# EAGLE design STM32L052_Breadboard (EAGLE 7.7.0)
CNAME: CC Attribution-ShareAlike 3.0; CREVISION: 1.0; DESIGNER: Oliv4945
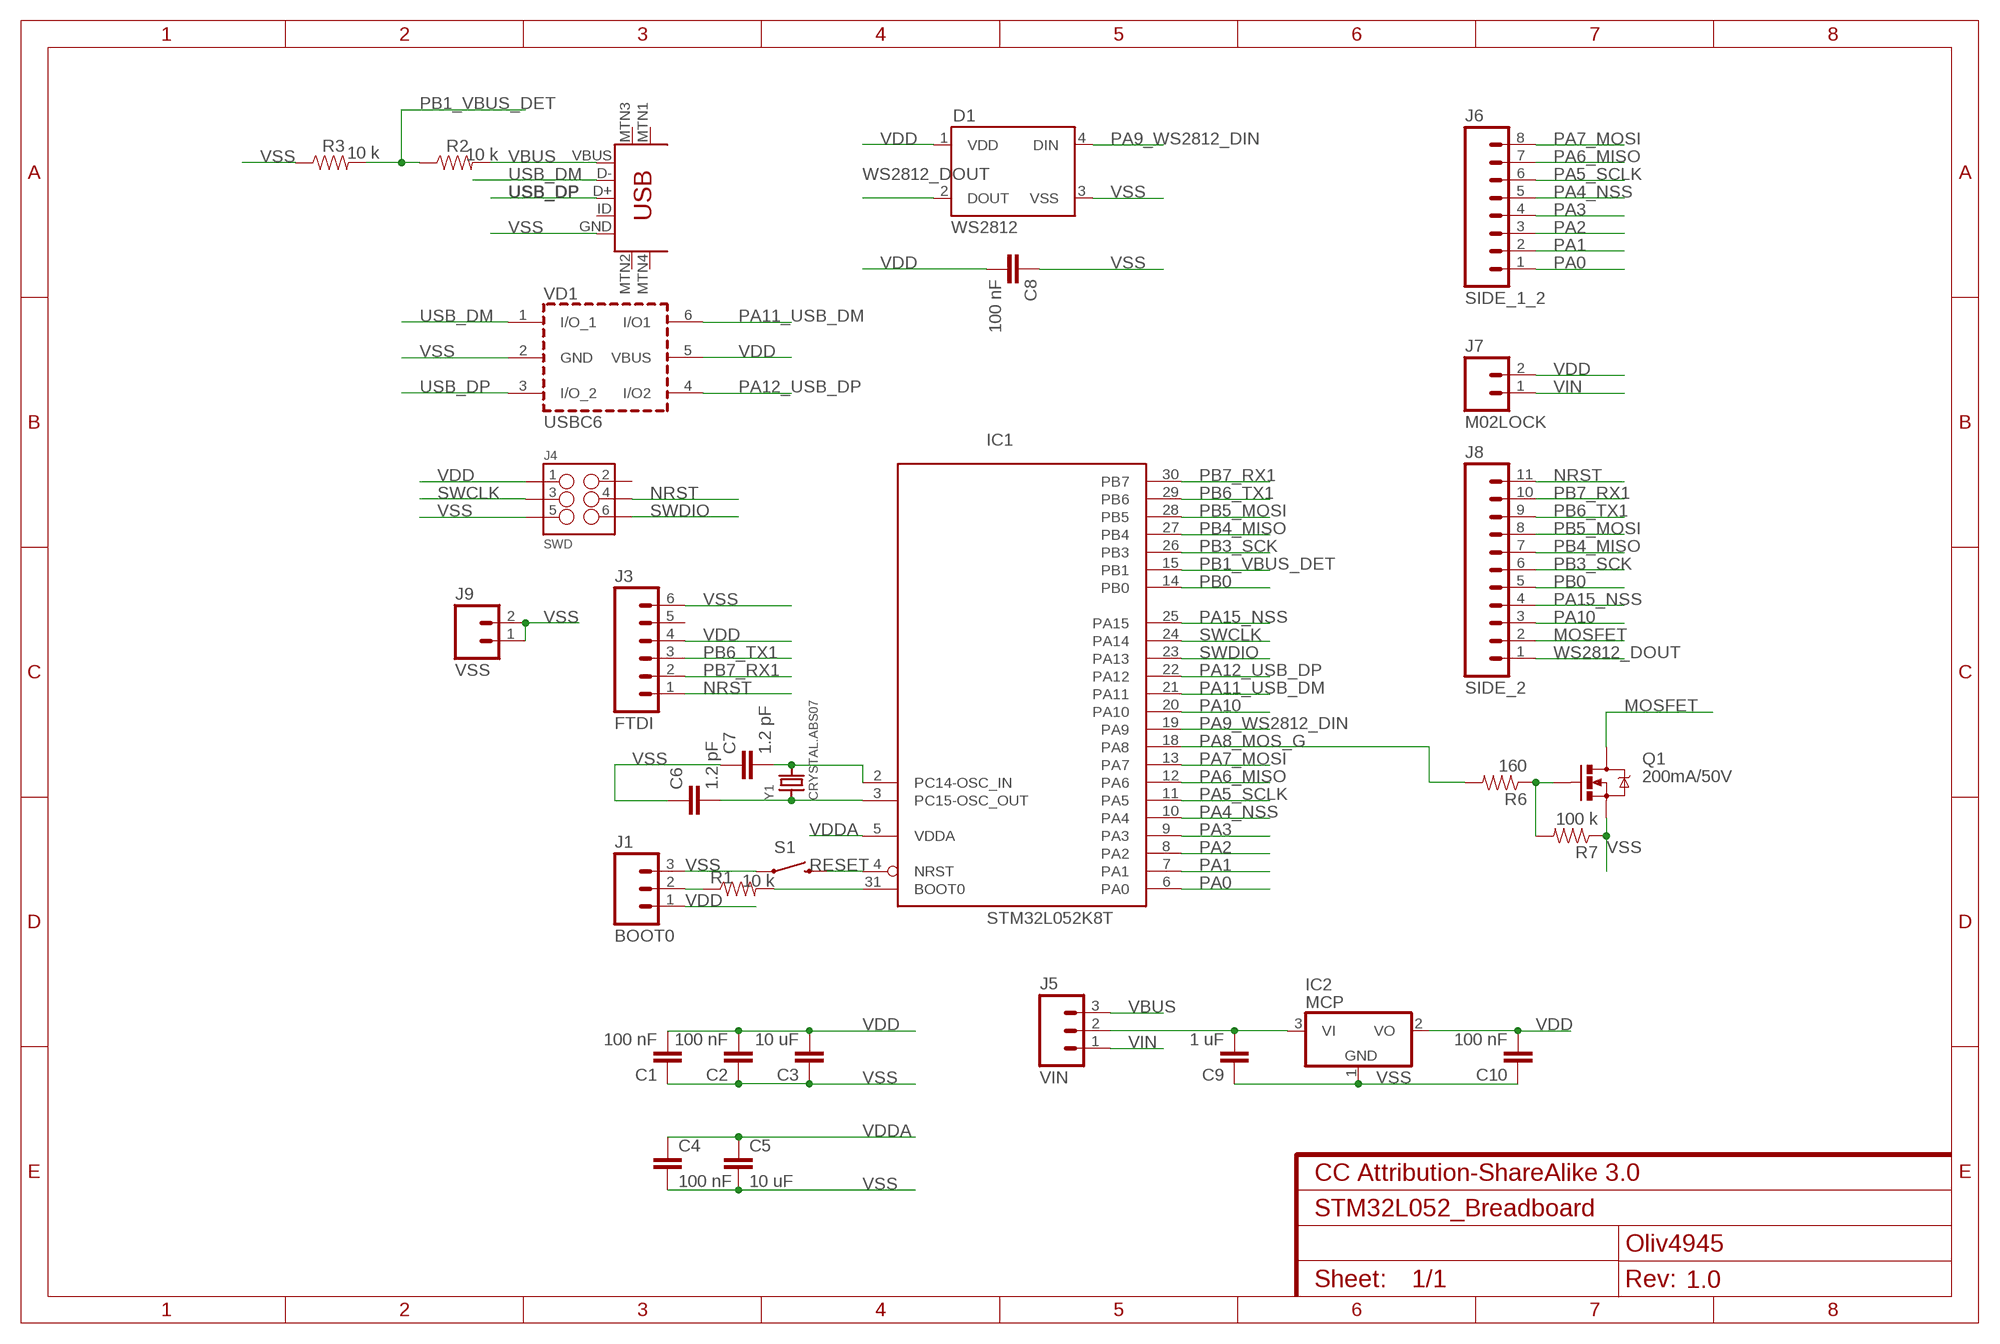
[diagram p0: schematic, sheet 1]

## Parts
C1  100 nF  CAP0603-CAP  [0603-CAP]
C2  100 nF  CAP0603-CAP  [0603-CAP]
C3  10 uF  CAP0603-CAP  [0603-CAP]
C4  100 nF  CAP0603-CAP  [0603-CAP]
C5  10 uF  CAP0603-CAP  [0603-CAP]
C6  1.2 pF  CAP0603-CAP  [0603-CAP]
C7  1.2 pF  CAP0603-CAP  [0603-CAP]
C8  100 nF  CAP0603-CAP  [0603-CAP]
C9  1 uF  CAP0603-CAP  [0603-CAP]
C10  100 nF  CAP0603-CAP  [0603-CAP]
D1  WS2812  WS2812B  [WS2812B]
IC1  STM32L052K8T  [LQFP32]
IC2  MCP  MCP1703CB  [SOT23]
J1  BOOT0  M03LOCK  [1X03_LOCK]
J3  FTDI  M06LOCK  [1X06_LOCK]
J4  SWD  M03X2FEMALE  [2X3]
J5  VIN  M03LOCK  [1X03_LOCK]
J6  SIDE_1_2  M08LOCK  [1X08_LOCK]
J7  M02LOCK  [1X02_LOCK]
J8  SIDE_2  M11LOCK  [1X11_LOCK]
J9  VSS  M02LOCK  [1X02_LOCK]
Q1  200mA/50V  MOSFET-NCHANNELBSS138  [SOT23-3]
R1  10 k  RESISTOR0603  [0603-RES]
R2  10 k  RESISTOR0603  [0603-RES]
R3  10 k  RESISTOR0603  [0603-RES]
R6  160  RESISTOR0805-RES  [0805]
R7  100 k  RESISTOR0805-RES  [0805]
S1  RESET  SWITCH-MOMENTARY-2SMD  [TACTILE-SWITCH-SMD]
U$1  USB-MINIB-5PIN  [USB-MINIB]
VD1  USBC6  USBLC6-2SC6  [SOT-23-6L]
Y1  CRYSTAL.ABS07  [ABS07]

## Nets
BOOT0: IC1.31(BOOT0) R1.2
BOOT0_SEL: J1.2 R1.1
MOSFET: J8.2 Q1.3(D)
N$11: Q1.1(G) R6.1 R7.2
NRST: IC1.4(NRST) J3.1 J4.4 J8.11 S1.3
OSC_IN: C7.2 IC1.2(PC14-OSC_IN) Y1.2
OSC_OUT: C6.2 IC1.3(PC15-OSC_OUT) Y1.1
PA0: IC1.6(PA0) J6.1
PA1: IC1.7(PA1) J6.2
PA2: IC1.8(PA2) J6.3
PA3: IC1.9(PA3) J6.4
PA4_NSS: IC1.10(PA4) J6.5
PA5_SCLK: IC1.11(PA5) J6.6
PA6_MISO: IC1.12(PA6) J6.7
PA7_MOSI: IC1.13(PA7) J6.8
PA8_MOS_G: IC1.18(PA8) R6.2
PA9_WS2812_DIN: D1.4(DIN) IC1.19(PA9)
PA10: IC1.20(PA10) J8.3
PA11_USB_DM: IC1.21(PA11) VD1.6(I/O1)
PA12_USB_DP: IC1.22(PA12) VD1.4(I/O2)
PA15_NSS: IC1.25(PA15) J8.4
PB0: IC1.14(PB0) J8.5
PB1_VBUS_DET: IC1.15(PB1) R2.1 R3.2
PB3_SCK: IC1.26(PB3) J8.6
PB4_MISO: IC1.27(PB4) J8.7
PB5_MOSI: IC1.28(PB5) J8.8
PB6_TX1: IC1.29(PB6) J3.3 J8.9
PB7_RX1: IC1.30(PB7) J3.2 J8.10
SWCLK: IC1.24(PA14) J4.3
SWDIO: IC1.23(PA13) J4.6
USB_DM: U$1.D- VD1.1(I/O_1)
USB_DP: U$1.D+ VD1.3(I/O_2)
VBUS: J5.3 R2.2 U$1.VBUS
VDD: C1.2 C2.2 C3.2 C8.2 C10.2 D1.1(VDD) IC2.2(VO) J1.1 J3.4 J4.1 J7.2 VD1.5(VBUS)
VDDA: C4.1 C5.1 IC1.5(VDDA)
VIN: J5.1 J7.1
VIN_ALL: C9.2 IC2.3(VI) J5.2
VSS: C1.1 C2.1 C3.1 C4.2 C5.2 C6.1 C7.1 C8.1 C9.1 C10.1 D1.3(VSS) IC2.1(GND) J1.3 J3.6 J4.5 J9.1 J9.2 Q1.2(S) R3.1 R7.1 S1.1 U$1.GND VD1.2(GND)
WS2812_DOUT: D1.2(DOUT) J8.1
Unconnected: J3.5 J4.2 U$1.ID U$1.MTN1(MTN2) U$1.MTN2(MTN3) U$1.MTN3(MTN1) U$1.MTN4

## Power pins joined to a net without a drawn wire
VDD: IC1.1(VDD) IC1.17(VDD)
VSS: IC1.16(VSS) IC1.32(VSS)

## Library data of the parts
C1-C10 = SparkFun-Capacitors:CAP: Capacitor Standard 0603 ceramic capacitor, and 0.1" leaded capacitor.
D1 = SparkFun-LED:WS2812B: WS2812B - Intelligent control LED integrated light source Technical Specifications: Power Supply Voltage (VDD): 3.5 to 5.3 V Input Voltage (VI): -0.5 to VDD+0.5 V Operating Junction Temperature (Topt): -25°C to +80°C Storage Temperature Range (Tstg): -55°C to +150°C; PROD_ID: DIO-12503
IC1 = micro-stm_v3:STM32L052K*T: ARM 32-bit Cortex™-M0+ CPU 32 MHz maximum frequency 32 to 64 Kbytes of Flash memory 2 kbyte of Data EEPROM 8 kbytes of SRAM 27 GPIOs 1.8 to 3.6 V application supply
IC2 = linear:MCP1703: 250 mA, 16V, Low Quiescent Current LDO Regulator Source: http://ww1.microchip.com/downloads/en/DeviceDoc/22049b.pdf
J1 J5 = SparkFun-Connectors:M03: Header 3 Standard 3-pin 0.1" header. Use with straight break away headers (SKU : PRT-00116), right angle break away headers (PRT-00553), swiss pins (PRT-00743), machine pins (PRT-00117), and female headers (PRT-00115). Molex polarized connector foot print use with SKU : PRT-08232 with associated crimp pins and housings.
J3 = SparkFun-Connectors:M06: Header 6 Standard 6-pin 0.1" header. Use with straight break away headers (SKU : PRT-00116), right angle break away headers (PRT-00553), swiss pins (PRT-00743), machine pins (PRT-00117), and female headers (PRT-00115). Molex polarized connector foot print use with SKU : PRT-08094 with associated crimp pins and housings. NOTES ON THE VARIANTS LOCK and LOCK_LONGPADS... This footprint was designed to help hold the alignment of a through-hole component (i.e. 6-pin header) while soldering it into place. You may notice that each hole has been shifted either up or down by 0.005 of an inch from it's more standard position (which is a perfectly straight line). This slight alteration caused the pins (the squares in the middle) to touch the edges of the holes. Because they are alternating, it causes a "brace" to hold the component in place. 0.005 has proven to be the perfect amount of "off-center" position when using our standard breakaway headers. Although looks a little odd when you look at the bare footprint, once you have a header in there, the alteration is very hard to notice. Also,if you push a header all the way into place, it is covered up entirely on the bottom side. This idea of altering the position of holes to aid alignment will be further integrated into the Sparkfun Library for other footprints. It can help hold any component with 3 or more connection pins.
J4 = SparkFun-Connectors:M03X2: 2x3 .1" header. Shrouded, with keying- CONN-10681 SMT- CONN-11415 Pogo pins- HW-11044; PROD_ID: CONN-11566; VALUE: FEMALE 2x3
J6 = SparkFun-Connectors:M08: Header 8 Standard 8-pin 0.1" header. Use with straight break away headers (SKU : PRT-00116), right angle break away headers (PRT-00553), swiss pins (PRT-00743), machine pins (PRT-00117), and female headers (PRT-00115).
J7 J9 = SparkFun-Connectors:M02: Standard 2-pin 0.1" header. Use with - straight break away headers ( PRT-00116) - right angle break away headers (PRT-00553) - swiss pins (PRT-00743) - machine pins (PRT-00117) - female headers (PRT-00115) Molex polarized connector foot print use with: PRT-08233 with associated crimp pins and housings. 2.54_SCREWTERM for use with PRT-10571. 3.5mm Screw Terminal footprints for PRT-08084 5mm Screw Terminal footprints for use with PRT-08432
J8 = SparkFun-Connectors:M11: Header 11 Standard 11-pin 0.1" header. Use with straight break away headers (SKU : PRT-00116), right angle break away headers (PRT-00553), swiss pins (PRT-00743), machine pins (PRT-00117), and female headers (PRT-00115).
Q1 = SparkFun-DiscreteSemi:MOSFET-NCHANNEL: Common NMOSFET Parts MFG P/N Store ID Prod ID FDD8780 TRANS-09984 SI7820DN TRANS-11055 FDS6630A IC-08089 2N7002PW TRANS-11151 FQP30N06L COM-10213 TRANS-10060 BSS123LT1G TRANS-08345 BSS138 TRANS-00830 BS170 2N7000; PROD_ID: TRANS-00830
R1-R3 = SparkFun-Resistors:RESISTOR: Resistor Basic schematic elements and footprints for 0603, 1206, and PTH resistors.
R6 R7 = SparkFun-Passives:RESISTOR: Resistor Basic schematic elements and footprints for 0603, 1206, and PTH resistors.
S1 = SparkFun-Electromechanical:SWITCH-MOMENTARY-2: Various NO switches- pushbuttons, reed, etc; PROD_ID: SWCH-08247
U$1 = SparkFun-Connectors:USB-MINIB: Mini-USB "B" connector with 5th pin broken out. Created new symbol breaking out 5th "ID" pin in mini/micro USB connector spec. See: http://en.wikipedia.org/wiki/Mini_usb#Cables. Uses same footprint as 4-pin symbol. Also added pins to connect to mounting / shield pads if required (probably not generally needed as signals aren't shielded once they leave the connector).
VD1 = usblc6:USBLC6-2: VERY LOW CAPACITANCE ESD PROTECTION 2 line Datasheet link <http://www.st.com/web/catalog/sense_power/FM114/CL1137/SC1489/PF93353>
Y1 = Abracorn:CRYSTAL

## Board
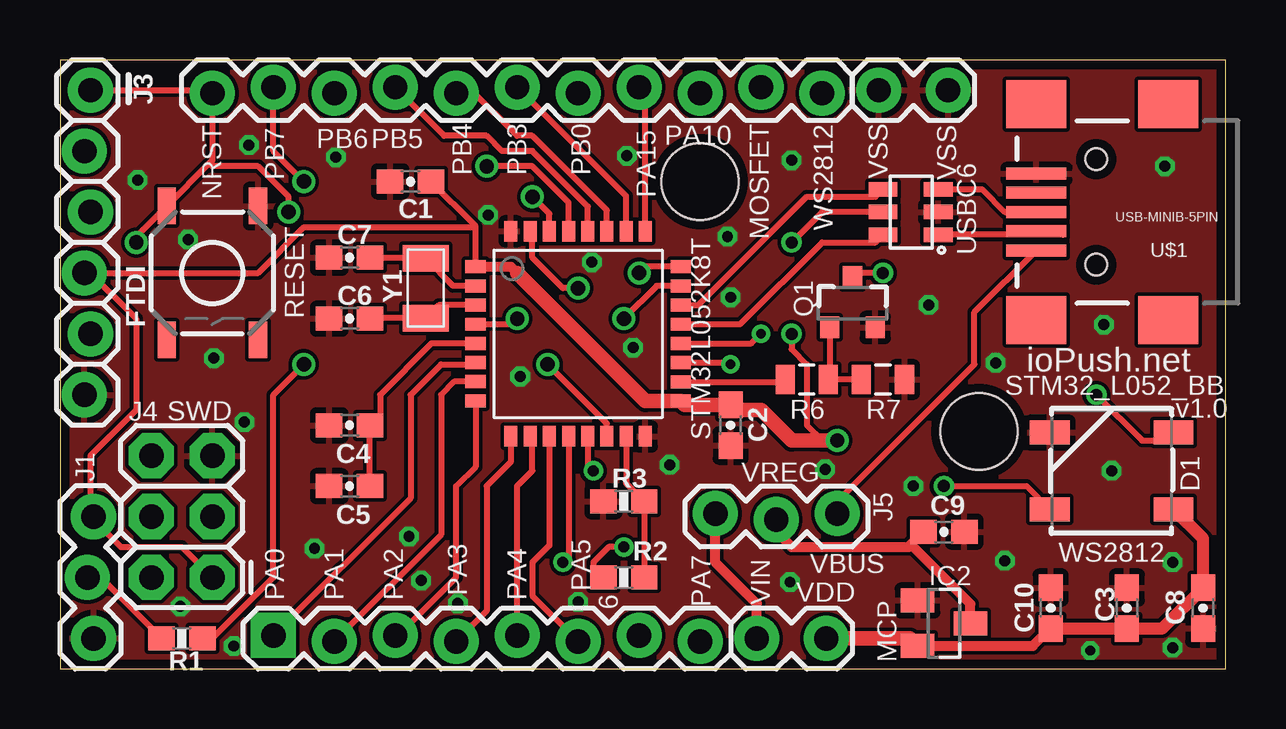
[diagram p1: board, top side]
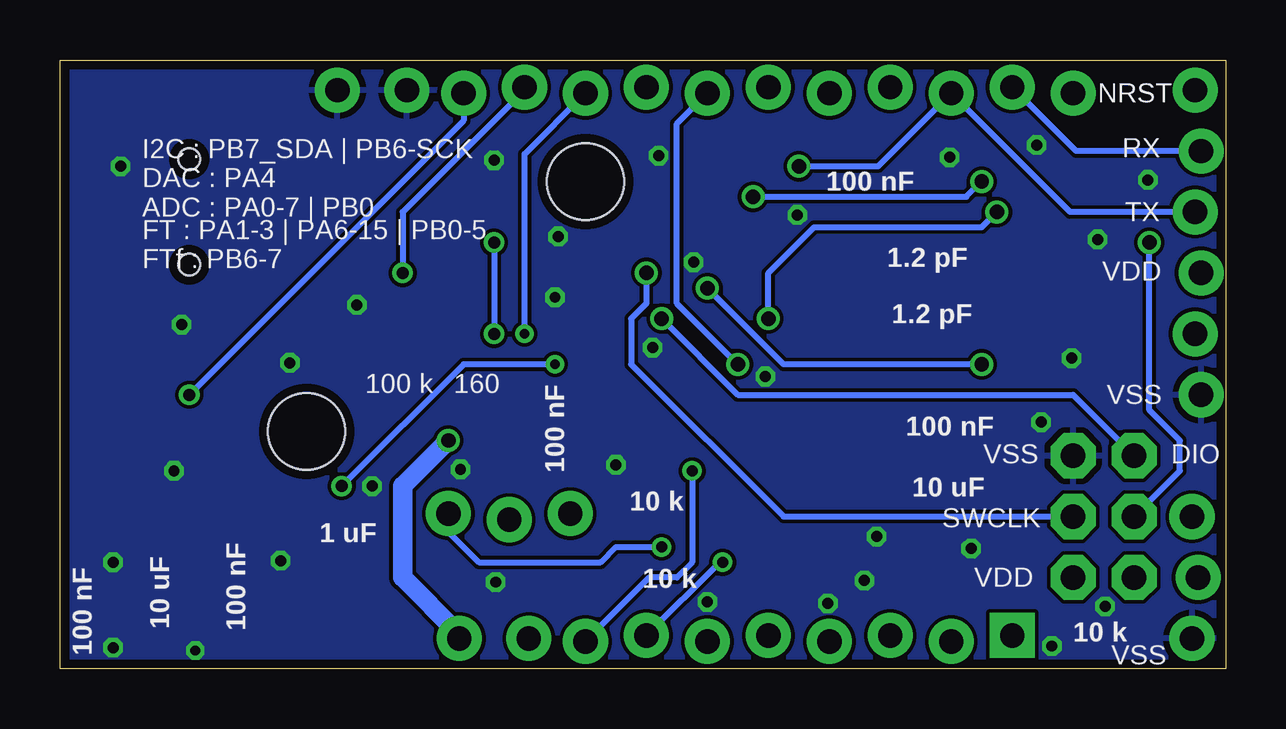
[diagram p2: board, bottom side, seen from below]

Size 48.56 x 25.39 mm. Coordinates in mm from the lower left corner, seen from the top.
Outline: 0,0 48.56,0 48.56,25.39 0,25.39 0,0
Copper layers (1*16): Top 0.0356mm / dielectric 1.5011mm / Bottom 0.0356mm
Design rules "oshpark-2layer": minimum track width 6mil, minimum drill 13mil, track to track 6mil, track to pad 6mil, pad to pad 6mil, via to via 6mil, smd to smd 6mil, copper to edge 15mil, drill to drill 6mil, minimum pad ring 7mil, minimum via ring 7mil, stop-mask expansion 2.5mil, vias tented up to drill 0mil, thermal gap 10mil
Holes 3.2 mm at 38.29,9.91 26.67,20.32

### Footprints (pad centres in the part's own frame; a part is rotated, then mirrored left to right if it is on the bottom)
0603-CAP = smd 1.1 x 1: 1 -0.85,0; 2 0.85,0
WS2812B = smd 1.651 x 1: 1 -2.577,1.6; 2 -2.577,-1.6; 3 2.577,-1.6; 4 2.577,1.6
LQFP32 = smd 0.54 x 0.85: 1 -2.8,-4.275; 2 -2,-4.275; 3 -1.2,-4.275; 4 -0.4,-4.275; 5 0.4,-4.275; 6 1.19,-4.275; 7 1.99,-4.275; 8 2.79,-4.275; 17 2.8,4.275; 18 2,4.275; 19 1.2,4.275; 20 0.4,4.275; 21 -0.4,4.275; 22 -1.2,4.275; 23 -2,4.275; 24 -2.8,4.275 | smd 0.85 x 0.54: 9 4.275,-2.8; 10 4.275,-2; 11 4.275,-1.2; 12 4.275,-0.4; 13 4.275,0.4; 14 4.275,1.2; 15 4.275,2; 16 4.275,2.8; 25 -4.275,2.8; 26 -4.275,2; 27 -4.275,1.2; 28 -4.275,0.4; 29 -4.275,-0.4; 30 -4.275,-1.2; 31 -4.275,-2; 32 -4.275,-2.8
SOT23 = smd 1 x 1.4: 1 -0.95,-1.1; 2 0.95,-1.1; 3 0,1.1
1X03_LOCK = drill 1.016 pad 1.88: 1 0,0.127; 2 2.54,-0.127; 3 5.08,0.127
1X06_LOCK = drill 1.016 pad 1.88: 1 0,0; 2 2.54,-0.254; 3 5.08,0; 4 7.62,-0.254; 5 10.16,0; 6 12.7,-0.254
2X3 = drill 1.016 pad 1.88 octagon: 1 0,0; 2 0,2.54; 3 2.54,0; 4 2.54,2.54; 5 5.08,0; 6 5.08,2.54
1X08_LOCK = drill 1.016 pad 1.88 square: 1 0,0.127 | drill 1.016 pad 1.88: 2 2.54,-0.127; 3 5.08,0.127; 4 7.62,-0.127; 5 10.16,0.127; 6 12.7,-0.127; 7 15.24,0.127; 8 17.78,-0.127
1X02_LOCK = drill 1.016 pad 1.88: 1 -0.178,0; 2 2.718,0
1X11_LOCK = drill 1.016 pad 1.88: 1 0,0.127; 2 2.54,-0.127; 3 5.08,0.127; 4 7.62,-0.127; 5 10.16,0.127; 6 12.7,-0.127; 7 15.24,0.127; 8 17.78,-0.127; 9 20.32,0.127; 10 22.86,-0.127; 11 25.4,0.127
SOT23-3 = smd 0.8 x 0.9: 1 -0.95,-1; 2 0.95,-1; 3 0,1.1
0603-RES = smd 1.1 x 1: 1 -0.85,0; 2 0.85,0
0805 = smd 0.8 x 1.2: 1 -0.9,0; 2 0.9,0
TACTILE-SWITCH-SMD = smd 1.524 x 0.762: 1 -2.794,1.905; 2 2.794,1.905; 3 -2.794,-1.905; 4 2.794,-1.905
USB-MINIB = smd 2.5 x 0.5: D+ 2.5,0; D- 2.5,0.8; GND 2.5,-1.6; ID 2.5,-0.8; VBUS 2.5,1.6 | smd 2.5 x 2: MTN1 -3,4.5; MTN2 2.5,4.5; MTN3 -3,-4.5; MTN4 2.5,-4.5 | hole 0.9: 0,2.2; 0,-2.2
SOT-23-6L = smd 0.6 x 1.2: 1 -0.95,-2.3; 2 0,-2.3; 3 0.95,-2.3; 4 0.95,0; 5 0,0; 6 -0.95,0
ABS07 = smd 1.1 x 1.9: 1 -1.25,0; 2 1.25,0

### Placement (x,y rotation side)
C1  14.61,20.32 0 top
C2  27.94,10.16 90 top
C3  44.45,2.54 270 top
C4  12.06,10.16 180 top
C5  12.06,7.62 180 top
C6  12.06,14.61 0 top
C7  12.06,17.14 0 top
C8  47.62,2.54 90 top
C9  36.83,5.71 180 top
C10  41.27,2.54 270 top
D1  43.81,8.26 180 top
IC1  21.59,13.97 270 top
IC2  36.83,1.91 270 top
J1  1.27,6.35 270 top
J3  1.27,24.13 270 top
J4  6.35,3.81 90 top
J5  27.3,6.35 0 top
J6  8.89,1.27 0 top
J7  29.21,1.27 0 top
J8  31.75,24.13 180 top
J9  34.29,24.13 0 top
Q1  33.02,15.24 0 top
R1  5.08,1.27 0 top
R2  23.5,3.81 180 top
R3  23.5,6.99 0 top
R6  31.11,12.06 180 top
R7  34.29,12.06 180 top
S1  6.35,16.51 270 top
U$1  43.18,19.05 180 top
VD1  34.29,19.05 90 top
Y1  15.24,15.88 90 top

### Tracks (layer width: path | path; a pad name or v marks a point on that pad's centre or on a via)
BOOT0  (via drill 0.6 pad 0.41)
  Top 0.254: R1.2 6.35,1.27 8.89,3.81 8.89,11.43 v10.16,12.7 | v21.59,15.88 20.95,15.88 19.68,17.14 19.68,18.15 IC1.31
  Bottom 0.254: v10.16,12.7 18.41,12.7 v21.59,15.88
BOOT0_SEL
  Top 0.254: J1.2 1.69,3.81 R1.1
MOSFET  (via drill 0.5)
  Top 0.254: v34.29,16.51 33.19,16.51 Q1.3
  Bottom 0.254: J8.2 29.21,24.13 34.29,19.05 v34.29,16.51
N$11
  Top 0.254: R7.2 R6.1 32.07,12.12 Q1.1
NRST  (via drill 0.6 pad 0.41)
  Top 0.254: v3.17,17.78 3.17,18.03 S1.3 6.22,21.08 | J3.1 6.22,24.13 J8.11 6.35,21.21 6.22,21.08 | IC1.4 18.82,14.37 v19.05,14.61 | v9.53,19.05 9.53,19.68 8.26,20.95 6.35,20.95 6.22,21.08
  Bottom 0.254: J4.4 1.91,8.26 1.91,9.53 3.17,10.79 v3.17,17.78 | v19.05,14.61 19.05,16.51 17.14,18.41 10.16,18.41 v9.53,19.05
OSC_IN
  Top 0.254: IC1.2 16.39,15.97 Y1.2 15.22,17.14 C7.2
OSC_OUT
  Top 0.254: IC1.3 15.79,15.17 Y1.1 12.94,14.62 C6.2
PA0
  Top 0.254: 17.23,12.78 IC1.6 17.23,12.7 15.88,12.7 14.61,11.43 14.61,7.11 J6.1
PA1
  Top 0.254: IC1.7 16.43,11.98 15.88,11.43 15.88,5.59 J6.2
PA2
  Top 0.254: IC1.8 17.32,8.43 16.51,7.62 16.51,3.81 14.1,1.4 J6.3
PA3
  Top 0.254: IC1.9 18.79,8.63 17.78,7.62 17.78,2.41 J6.4
PA4_NSS
  Top 0.254: J6.5 19.05,7.62 19.68,8.26 19.68,9.6 IC1.10
PA5_SCLK
  Top 0.254: IC1.11 20.39,5.15 19.68,4.45 19.68,3.05 J6.6
PA6_MISO  (via drill 0.46)
  Top 0.254: IC1.12 21.19,4.68 v20.95,4.45
  Bottom 0.254: v20.95,4.45 21.08,4.45 J6.7
PA7_MOSI  (via drill 0.46)
  Top 0.254: IC1.13 21.99,8.49 v22.23,8.26
  Bottom 0.254: v22.23,8.26 22.23,4.45 22.86,3.81 24,3.81 J6.8
PA8_MOS_G
  Top 0.254: IC1.18 30.12,11.97 R6.2
PA9_WS2812_DIN  (via drill 0.41 pad 0.41, 0.5)
  Top 0.254: IC1.19 27.87,12.77 v27.94,12.7 | v36.83,7.62 40.27,7.62 D1.4
  Bottom 0.254: v27.94,12.7 31.75,12.7 v36.83,7.62
PA10  (via drill 0.41)
  Top 0.254: IC1.20 28.81,13.57 v29.21,13.97
  Bottom 0.254: v29.21,13.97 29.21,21.46 J8.3
PA11_USB_DM
  Top 0.254: IC1.21 28.34,14.37 31.75,17.78 33.97,17.78 VD1.6
PA12_USB_DP
  Top 0.254: IC1.22 26.6,15.17 31.11,19.68 33.98,19.68 VD1.4
PA15_NSS
  Top 0.254: IC1.25 24.39,24 J8.4
PB0  (via drill 0.6 pad 0.41)
  Top 0.254: IC1.14 22.79,10.23 v20.32,12.7
  Bottom 0.254: v20.32,12.7 22.86,15.24 22.86,22.73 J8.5
PB1_VBUS_DET
  Top 0.254: IC1.15 23.59,7.74 R3.2 R2.1
PB3_SCK
  Top 0.254: IC1.26 23.59,19.72 J8.6
PB4_MISO
  Top 0.254: IC1.27 22.79,19.12 19.68,22.23 19.05,22.23 17.14,24.13 16.64,24.13 J8.7
PB5_MOSI
  Top 0.254: IC1.28 21.99,19.29 19.68,21.59 18.41,21.59 17.78,22.23 16,22.23 J8.8
PB6_TX1  (via drill 0.6 pad 0.41)
  Top 0.254: IC1.29 21.19,19.45 19.68,20.95 v17.78,20.95
  Bottom 0.254: J3.3 6.48,19.05 J8.9 14.48,20.95 v17.78,20.95
PB7_RX1  (via drill 0.6 pad 0.41)
  Top 0.254: IC1.30 20.39,18.98 v19.68,19.68 | v10.16,20.32 8.89,21.59 J8.10
  Bottom 0.254: J3.2 6.22,21.59 J8.10 | v19.68,19.68 10.79,19.68 v10.16,20.32
SWCLK  (via drill 0.6 pad 0.41)
  Top 0.254: IC1.24 24.39,16.77 v24.13,16.51
  Bottom 0.254: v24.13,16.51 24.13,15.24 24.77,14.61 24.77,12.7 18.41,6.35 J4.3
SWDIO  (via drill 0.6 pad 0.41)
  Top 0.254: IC1.23 24.86,15.97 v23.5,14.61
  Bottom 0.254: v23.5,14.61 20.32,11.43 6.35,11.43 J4.6
USB_DM
  Top 0.254: U$1.D- 41.8,18.1 VD1.1
USB_DP
  Top 0.254: VD1.3 38.42,20 39.37,19.05 U$1.D+
VBUS  (via drill 0.46)
  Top 0.254: v23.5,5.08 22.86,5.08 22.23,4.45 22.23,4.23 R2.2 | J5.3 32.38,6.99 38.1,12.7 38.1,14.87 U$1.VBUS
  Bottom 0.254: J5.3 32.38,5.71 31.11,4.45 26.04,4.45 25.4,5.08 v23.5,5.08
VDD  (via drill 0.5, 0.6)
  Top 0.254: J4.1 5.08,5.08 2.54,5.08 1.4,6.22 J1.1 1.27,6.48 1.27,8.89 3.17,10.79 3.17,14.61 1.27,16.51 J3.4 8.26,16.51 10.16,18.41 17.14,18.41 17.25,18.52 | IC1.1 17.32,18.46 17.25,18.52 | 17.25,18.52 C1.2 | VD1.5 31.75,19.05 v30.48,17.78 | v30.48,13.97 30.48,13.34 31.11,12.7 31.11,10.16 31.75,9.53
  Top 0.406: 35.41,1.27 IC2.2 40.54,0.95 C10.2 | IC1.1 18.79,16.77 19.05,16.51
  Top 0.508: C10.2 C3.2 45.92,1.69 C8.2 47.62,5.42 D1.1
  Top 0.61: J7.2 35.41,1.27 | v32.38,9.53 31.75,9.53 30.48,9.53 29.21,10.79 28.16,10.79 C2.2 26.02,11.01 IC1.17 24.39,11.17 19.05,16.51
  Bottom 0.254: v30.48,17.78 v30.48,13.97
  Bottom 0.813: J7.2 31.93,1.45 34.29,3.81 34.29,7.62 v32.38,9.53
VDDA
  Top 0.254: 13.34,10.16 C4.1 | C5.1 C4.1 | IC1.5 15.47,13.57 13.34,11.43 13.34,10.58 C4.1
VIN
  Top 0.406: J7.1 29.03,2.72 27.3,4.45 J5.1
VIN_ALL
  Top 0.406: J5.2 29.84,5.71 30.48,5.08 35.34,5.08 35.45,5.19 | 35.45,5.19 C9.2 | IC2.3 37.93,2.71 35.45,5.19
VSS  (via drill 0.41 pad 0.61, 0.46)
  other vias: 46.04,20.95 43.5,14.35 43.81,8.26 46.35,4.45 39.37,4.51 46.35,0.89 42.93,0.76 35.56,7.62 38.99,12.76 36.2,15.18 27.81,18.03 30.48,21.21 27.94,15.49 30.42,3.62 31.88,8.32 25.4,8.51 21.59,2.79 23.62,21.4 22.16,16.95 23.88,13.4 19.18,12.19 14.54,5.52 15.05,3.68 16.57,2.73 7.24,0.95 10.6,5.02 5.02,2.6 7.68,10.29 6.41,12.95 5.33,17.91 3.24,20.38 11.49,21.34 17.84,18.92 7.87,21.84
  pour Bottom: 48.9,25.4 48.9,0 0,0 0,25.4
  pour Top: 48.9,25.4 48.9,0 0,0 0,25.4
WS2812_DOUT  (via drill 0.5)
  Top 0.254: v43.18,11.43 45.09,9.53 46.06,9.53 D1.2
  Bottom 0.254: J8.1 31.75,22.86 v43.18,11.43

### Text on the board
tNames: NRST | PA10 | PB6 | PB5 | PA15 | PB4 | PB3 | PB0 | PB7 | VSS | MOSFET | WS2812 | ioPush.net | STM32_L052_BB | v1.0 | VREG | PA7 | VIN | VBUS | VDD | PA0 | PA1 | PA2 | PA3 | PA4 | PA5 | 6
bNames: NRST | RX | TX | I2C : PB7_SDA | PB6-SCK / DAC : PA4 / ADC : PA0-7 | PB0 | FT : PA1-3 | PA6-15 | PB0-5 / FTf : PB6-7 | VDD | VSS | DIO | VSS | SWCLK | VDD | VSS